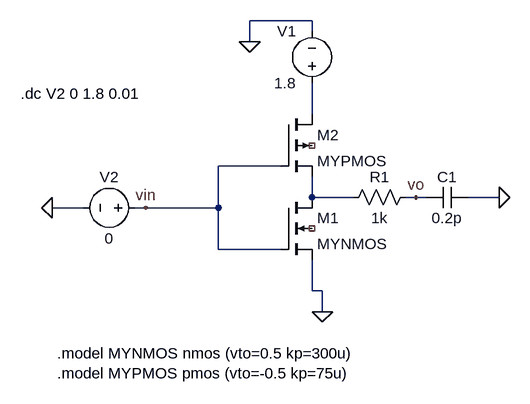
[diagram p0: schematic parta.asc]
parta.asc, the LTspice schematic file:
Version 4.1
SHEET 1 880 680
WIRE 208 -144 112 -144
WIRE 208 -128 208 -144
WIRE 112 -112 112 -144
WIRE 208 0 208 -48
WIRE 160 80 64 80
WIRE 208 128 208 96
WIRE 272 128 208 128
WIRE 368 128 352 128
WIRE 384 128 368 128
WIRE 496 128 448 128
WIRE -144 144 -192 144
WIRE -48 144 -64 144
WIRE 64 144 64 80
WIRE 64 144 -48 144
WIRE 64 208 64 144
WIRE 160 208 64 208
WIRE 208 272 208 224
WIRE 224 272 208 272
WIRE 224 304 224 272
FLAG 224 304 0
FLAG 112 -112 0
FLAG -192 144 0
FLAG 368 128 vo
FLAG 496 128 0
FLAG -48 144 vin
SYMBOL nmos4 160 128 R0
SYMATTR InstName M1
SYMATTR Value MYNMOS
SYMATTR Value2 l=0.18u w=0.9u
SYMBOL pmos4 160 0 R0
SYMATTR InstName M2
SYMATTR Value MYPMOS
SYMATTR Value2 l=0.18u w=2.25u
SYMBOL voltage 208 -32 R180
WINDOW 0 24 96 Left 2
WINDOW 3 24 16 Left 2
WINDOW 123 0 0 Left 0
WINDOW 39 0 0 Left 0
SYMATTR InstName V1
SYMATTR Value 1.8
SYMBOL voltage -48 144 R90
WINDOW 0 -32 56 VBottom 2
WINDOW 3 32 56 VTop 2
WINDOW 123 0 0 Left 0
WINDOW 39 0 0 Left 0
SYMATTR InstName V2
SYMATTR Value 0
SYMBOL res 368 112 R90
WINDOW 0 0 56 VBottom 2
WINDOW 3 32 56 VTop 2
SYMATTR InstName R1
SYMATTR Value 1k
SYMBOL cap 448 112 R90
WINDOW 0 0 32 VBottom 2
WINDOW 3 32 32 VTop 2
SYMATTR InstName C1
SYMATTR Value 0.2p
TEXT -184 368 Left 2 !.model MYNMOS nmos (vto=0.5 kp=300u)\n.model MYPMOS pmos (vto=-0.5 kp=75u)
TEXT -240 -32 Left 2 !.dc V2 0 1.8 0.01

The netlist it stands for:
* parta.asc
M1 N002 vin 0 NC_01 MYNMOS l=0.18u w=0.9u
M2 N001 vin N002 NC_02 MYPMOS l=0.18u w=2.25u
V1 N001 0 1.8
V2 vin 0 0
R1 vo N002 1k
C1 0 vo 0.2p
.model NMOS NMOS
.model PMOS PMOS
.lib standard.mos
.model MYNMOS nmos (vto=0.5 kp=300u)
.model MYPMOS pmos (vto=-0.5 kp=75u)
.dc V2 0 1.8 0.01
.backanno
.end

* Results of the author's LTspice run, read from the files saved beside the schematic
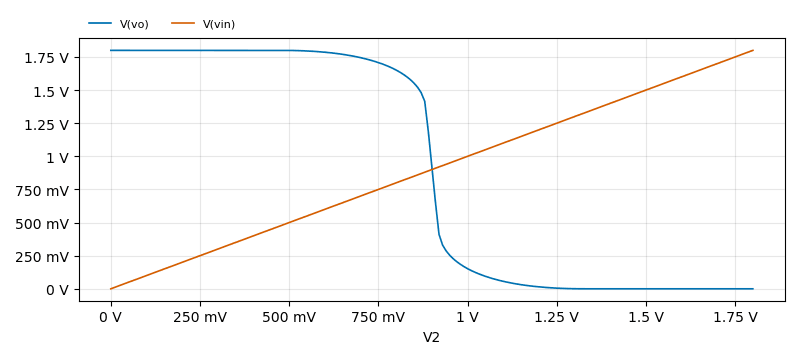
[diagram p1: DC transfer characteristic of parta.asc, plotted from the saved traces]
* DC transfer characteristic, 1 run:
*   V(vo): 1.8 V at V2=0 V, 1.243 nV at V2=1.8 V, min -16.61 nV, max 1.8 V
*   V(vin): 0 V at V2=0 V, 1.8 V at V2=1.8 V, min 0 V, max 1.8 V